# EAGLE design IotaWatt (EAGLE 8.0.0)
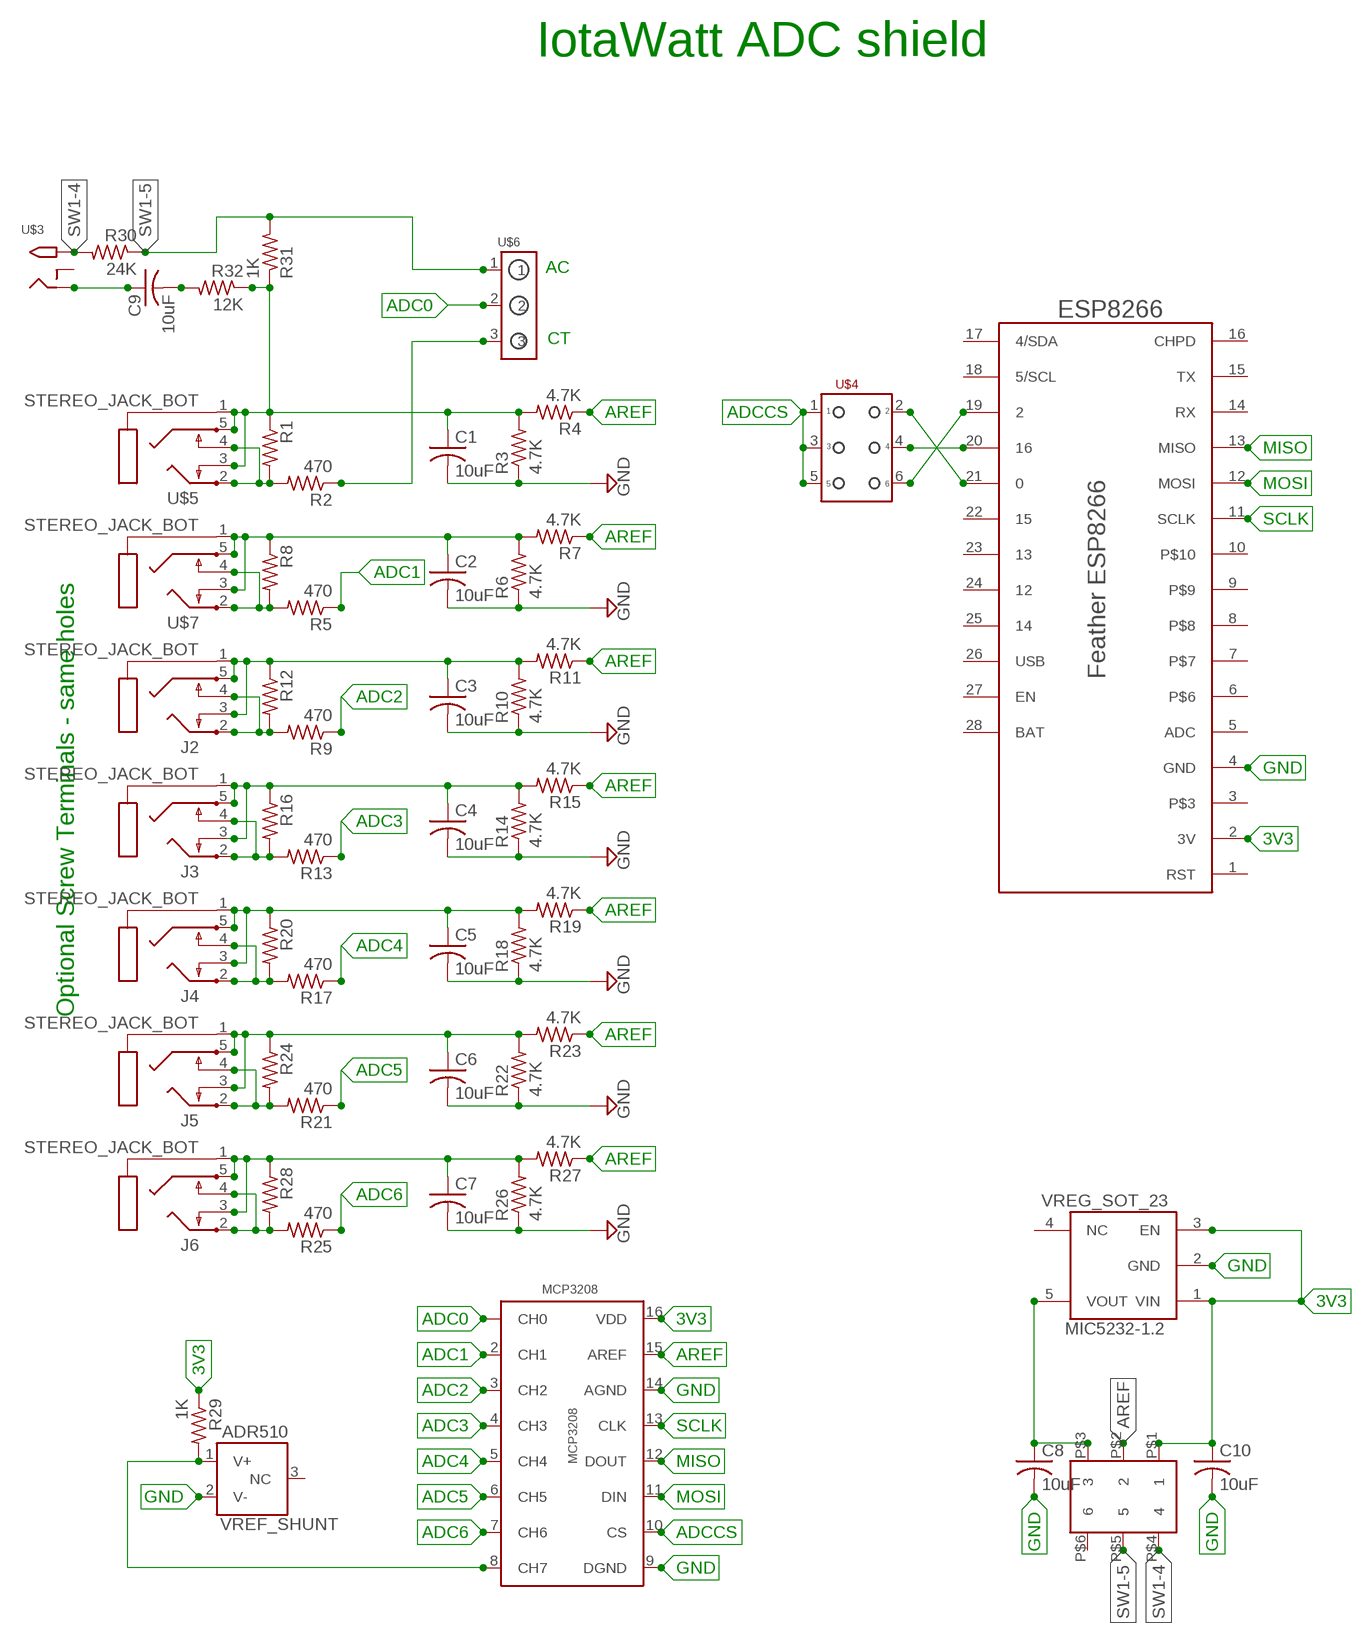
[diagram p0: schematic, sheet 1]

## Parts
ADR510  VREF_SHUNT  [SOT23_3]
C1  10uF  C-USC0805  [C0805]
C2  10uF  C-USC0805  [C0805]
C3  10uF  C-USC0805  [C0805]
C4  10uF  C-USC0805  [C0805]
C5  10uF  C-USC0805  [C0805]
C6  10uF  C-USC0805  [C0805]
C7  10uF  C-USC0805  [C0805]
C8  10uF  C-USC0805  [C0805]
C9  10uF  C-USC0805  [C0805]
C10  10uF  C-USC0805  [C0805]
J2  STEREO_JACK_BOT  [STX3100]
J3  STEREO_JACK_BOT  [STX3100]
J4  STEREO_JACK_BOT  [STX3100]
J5  STEREO_JACK_BOT  [STX3100]
J6  STEREO_JACK_BOT  [STX3100]
MCP3208  MCP3208  [SOIC_16]
MIC5232-1.2  VREG_SOT_23  [SOT23_5]
R1  R-US_FLIPFLOP7  [0805-THM-7]
R2  470  R-US_R0805  [R0805]
R3  4.7K  R-US_R0805  [R0805]
R4  4.7K  R-US_R0805  [R0805]
R5  470  R-US_R0805  [R0805]
R6  4.7K  R-US_R0805  [R0805]
R7  4.7K  R-US_R0805  [R0805]
R8  R-US_FLIPFLOP7  [0805-THM-7]
R9  470  R-US_R0805  [R0805]
R10  4.7K  R-US_R0805  [R0805]
R11  4.7K  R-US_R0805  [R0805]
R12  R-US_FLIPFLOP7  [0805-THM-7]
R13  470  R-US_R0805  [R0805]
R14  4.7K  R-US_R0805  [R0805]
R15  4.7K  R-US_R0805  [R0805]
R16  R-US_FLIPFLOP7  [0805-THM-7]
R17  470  R-US_R0805  [R0805]
R18  4.7K  R-US_R0805  [R0805]
R19  4.7K  R-US_R0805  [R0805]
R20  R-US_FLIPFLOP7  [0805-THM-7]
R21  470  R-US_R0805  [R0805]
R22  4.7K  R-US_R0805  [R0805]
R23  4.7K  R-US_R0805  [R0805]
R24  R-US_FLIPFLOP7  [0805-THM-7]
R25  470  R-US_R0805  [R0805]
R26  4.7K  R-US_R0805  [R0805]
R27  4.7K  R-US_R0805  [R0805]
R28  R-US_FLIPFLOP7  [0805-THM-7]
R29  1K  R-US_R0805  [R0805]
R30  24K  R-US_R0805  [R0805]
R31  1K  R-US_R0805  [R0805]
R32  12K  R-US_R0805  [R0805]
U$1  ESP8266FEATHER  [FEATHERWING]
U$3  2.1MMJACKBOTTHM  [PJ-102A-BOT]
U$4  HEADER_2X3  [HEADER_2X3]
U$5  STEREO_JACK_BOT  [STX3100]
U$6  HEADER_1X3  [HEADER_1X3]
U$7  STEREO_JACK_BOT  [STX3100]
U$8  DPDT_SMT_SW  [JS202011SCQN]

## Nets
3V3: C10.1 MCP3208.16(VDD) MIC5232-1.2.1(VIN) MIC5232-1.2.3(EN) R29.1 U$1.2(3V) U$8.P$1
ADC0: MCP3208.1(CH0) U$6.2
ADC1: MCP3208.2(CH1) R5.1
ADC2: MCP3208.3(CH2) R9.1
ADC3: MCP3208.4(CH3) R13.1
ADC4: MCP3208.5(CH4) R17.1
ADC5: MCP3208.6(CH5) R21.1
ADC6: MCP3208.7(CH6) R25.1
ADC7: ADR510.1(V+) MCP3208.8(CH7) R29.2
ADCCS: MCP3208.10(CS) U$4.1 U$4.3 U$4.5
AREF: MCP3208.15(AREF) R4.1 R7.1 R11.1 R15.1 R19.1 R23.1 R27.1 U$8.P$2
GND: ADR510.2(V-) C1.2 C2.2 C3.2 C4.2 C5.2 C6.2 C7.2 C8.2 C10.2 MCP3208.9(DGND) MCP3208.14(AGND) MIC5232-1.2.2(GND) R3.1 R6.1 R10.1 R14.1 R18.1 R22.1 R26.1 U$1.4(GND)
MISO: MCP3208.12(DOUT) U$1.13(MISO)
MOSI: MCP3208.11(DIN) U$1.12(MOSI)
N$1: R2.1 U$6.3
N$2: C1.1 R1.1 R3.2 R4.2 R31.1 R32.1 U$5.1 U$5.3 U$5.5
N$3: U$1.21 U$4.2
N$4: C2.1 R6.2 R7.2 R8.1 U$7.1 U$7.3 U$7.5
N$5: J2.2 J2.4 R9.2 R12.2
N$6: U$1.19 U$4.6
N$9: U$1.20 U$4.4
N$11: R1.2 R2.2 U$5.2 U$5.4
N$12: C3.1 J2.1 J2.3 J2.5 R10.2 R11.2 R12.1
N$13: C5.1 J4.1 J4.3 J4.5 R18.2 R19.2 R20.1
N$14: J5.2 J5.4 R21.2 R24.2
N$16: C6.1 J5.1 J5.3 J5.5 R22.2 R23.2 R24.1
N$17: C9.2 R32.2
N$18: J6.2 J6.4 R25.2 R28.2
N$19: C7.1 J6.1 J6.3 J6.5 R26.2 R27.2 R28.1
N$20: R5.2 R8.2 U$7.2 U$7.4
N$21: J3.2 J3.4 R13.2 R16.2
N$22: C4.1 J3.1 J3.3 J3.5 R14.2 R15.2 R16.1
N$24: C8.1 MIC5232-1.2.5(VOUT) U$8.P$3
N$26: J4.2 J4.4 R17.2 R20.2
N$27: C9.1 U$3.RING
SCLK: MCP3208.13(CLK) U$1.11(SCLK)
SW1-4: R30.2 U$3.TIP U$8.P$4
SW1-5: R30.1 R31.2 U$6.1 U$8.P$5
Unconnected: ADR510.3(NC) MIC5232-1.2.4(NC) U$1.1(RST) U$1.3 U$1.5(ADC) U$1.6 U$1.7 U$1.8 U$1.9 U$1.10 U$1.14(RX) U$1.15(TX) U$1.16(CHPD) U$1.17(4/SDA) U$1.18(5/SCL) U$1.22 U$1.23 U$1.24 U$1.25 U$1.26(USB) U$1.27(EN) U$1.28(BAT) U$3.RING_SW U$8.P$6

## Notes on the sheet
- IotaWatt ADC shield
- AC
- CT
- Optional Screw Terminals - same holes

## Library data of the parts
ADR510 = IotaWatt_parts:VREF_SHUNT: Voltage Reference Shunt - SOT23-3 (ADR504, etc.)
C1-C10 = adafruit:C-US: CAPACITOR, American symbol
J2-J6 U$5 U$7 = IotaWatt_parts:STEREO_JACK_BOT: Stereo Jack - Bottom Mount
MCP3208 = IotaWatt_parts:MCP3208: MCP3208 12bit SPI ADC
MIC5232-1.2 = IotaWatt_parts:VREG_SOT_23: Generic SOT23-3 Voltage Regulator (MIC5232, etc.)
R1-R32 = adafruit:R-US_: RESISTOR, American symbol
U$1 = IotaWatt_parts:ESP8266FEATHER: Adafruit ESP8266 Feather
U$3 = IotaWatt_parts:2.1MMJACKBOT: Bottom Mount 2.1mm x 5.5mm THM DC jack with internal switch. Digikey part #PJ-102A, 4UCON part #05537 2.1mm x 5.5mm SMT DC jack with internal switch. Digikey part #PJ-002A-SMT, 4UCON part #03267 By microbuilder.eu & adafruit.com
U$4 = IotaWatt_parts:HEADER_2X3: Header 2x3
U$6 = IotaWatt_parts:HEADER_1X3
U$8 = IotaWatt_parts:DPDT_SMT_SW: DPDT smt Switch C&K JS202011SCQN Digikey 401-2002-1-ND

## Board
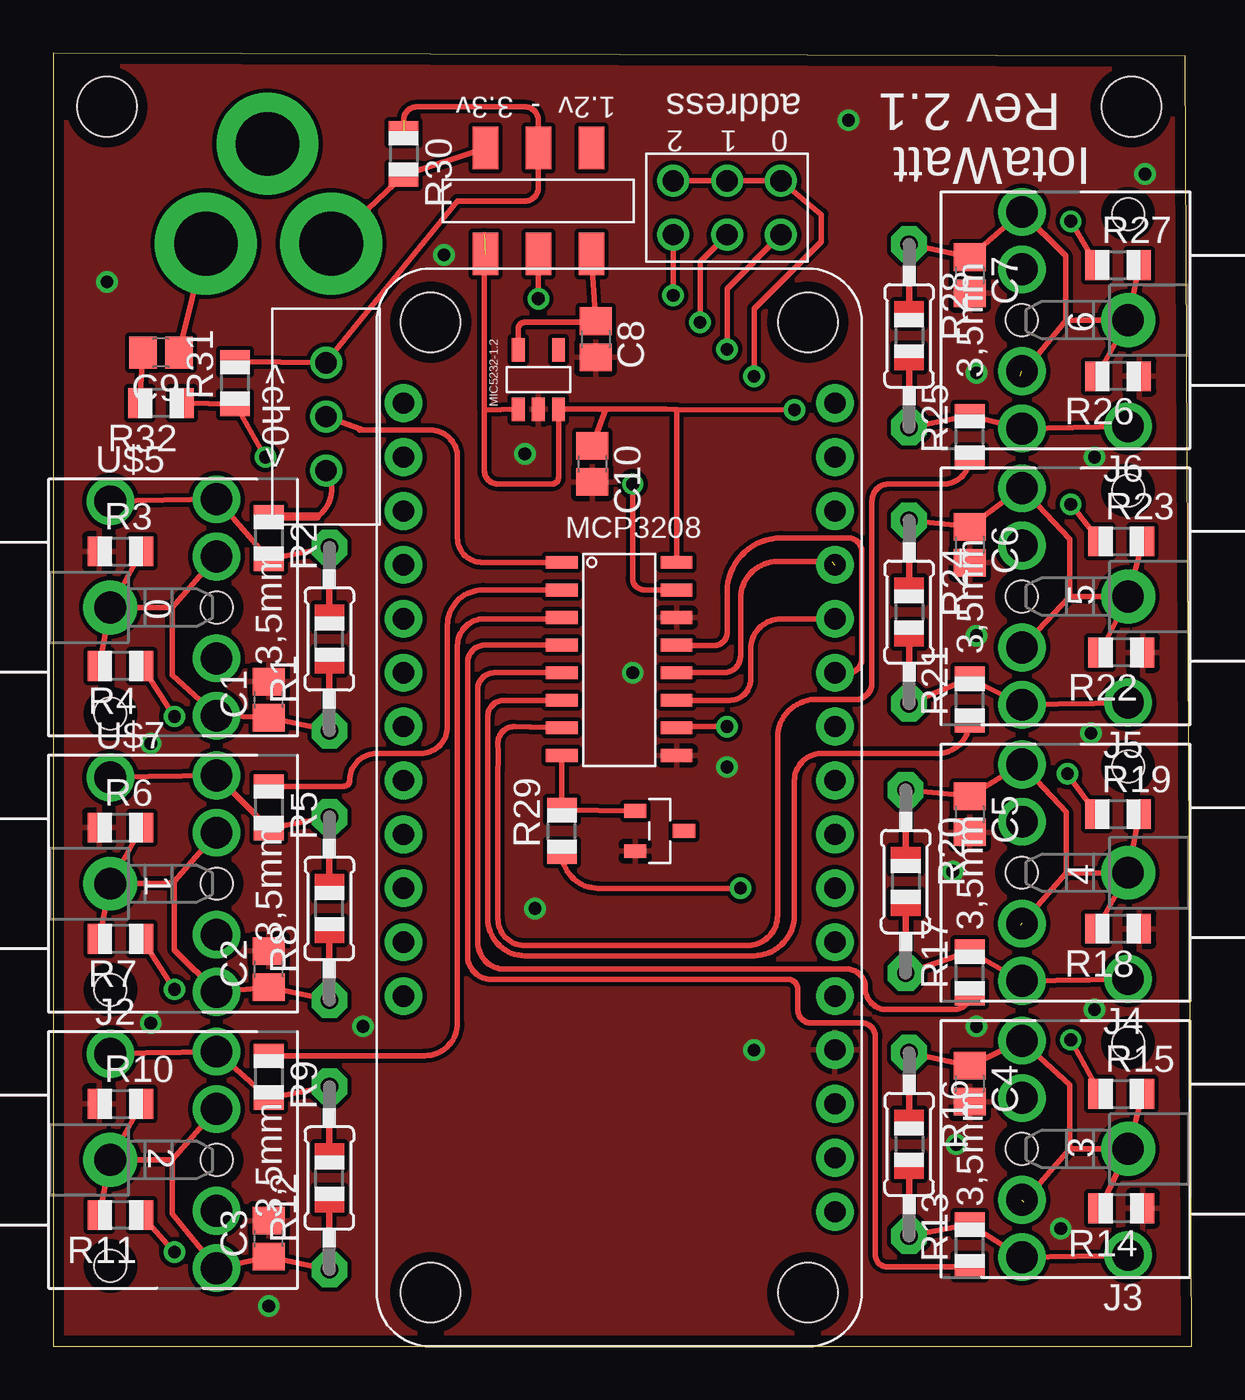
[diagram p1: board, top side]
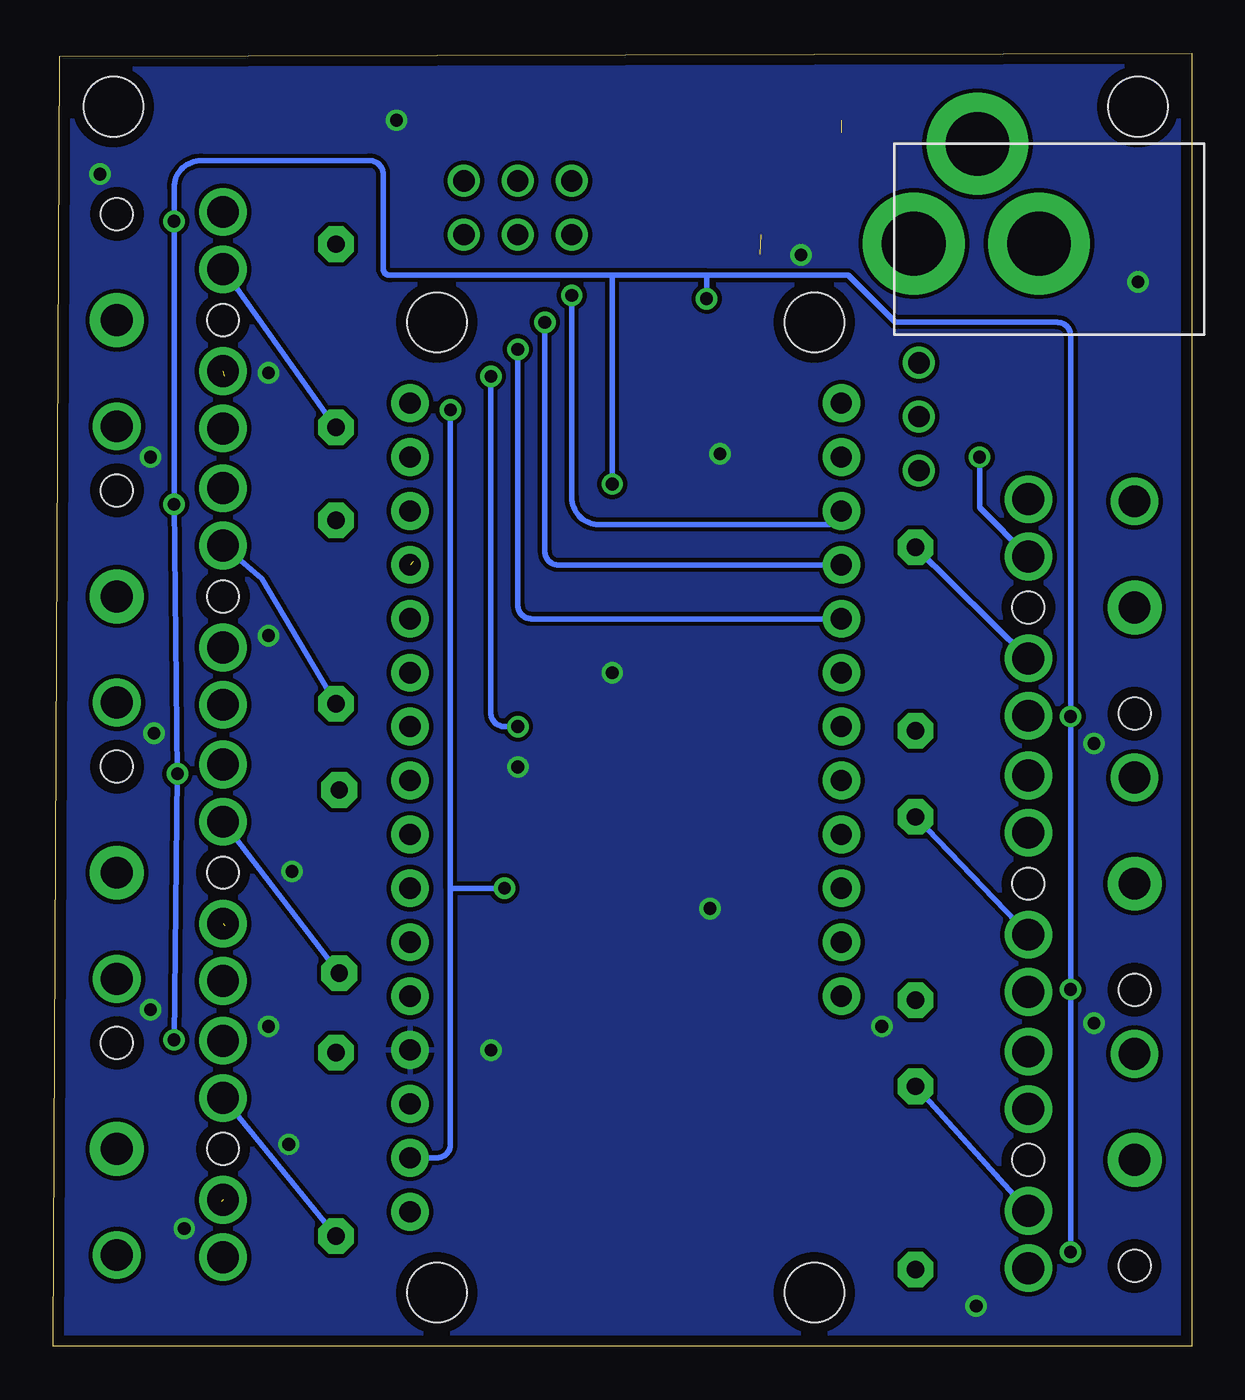
[diagram p2: board, bottom side, seen from below]

Size 53.65 x 60.95 mm. Coordinates in mm from the lower left corner, seen from the top.
Outline: 0,0 53.65,0 53.33,60.79 0,60.95 0,0
Copper layers (1*16): Top 0.035mm / dielectric 1.5mm / Bottom 0.035mm
Design rules "default *": minimum track width 10mil, minimum drill 10mil, track to track 8mil, track to pad 8mil, pad to pad 8mil, via to via 8mil, smd to smd 0mil, copper to edge 20mil, drill to drill 8mil, minimum pad ring 10mil, minimum via ring 8mil, stop-mask expansion 4mil, vias tented up to drill 0mil, thermal gap 10mil
Holes 2.8 mm at 17.78,2.54 35.56,2.54 17.78,48.26 35.56,48.26 2.54,58.42 50.8,58.42

### Footprints (pad centres in the part's own frame; a part is rotated, then mirrored left to right if it is on the bottom)
SOT23_3 = smd 1.05 x 0.65: 1 -1.15,0.95; 2 -1.15,-0.95; 3 1.15,0
C0805 = smd 1.3 x 1.5: 1 -0.85,0; 2 0.85,0
STX3100 = drill 1.5 pad 2.54: 1 2.7,-0.1 | drill 1.5: 2 7.7,5; 3 7.7,2.3; 4 7.7,-2.5; 5 7.7,-5.2; P$1 2.7,4.9 | hole 1.5: 2.7,-5.1; 7.7,-0.1
SOIC_16 = smd 1.5 x 0.6: 1 -2.7,5.2; 2 -2.7,3.9; 3 -2.7,2.6; 4 -2.7,1.3; 5 -2.7,0; 6 -2.7,-1.3; 7 -2.7,-2.6; 8 -2.7,-3.9; 9 2.7,-3.9; 10 2.7,-2.6; 11 2.7,-1.3; 12 2.7,0; 13 2.7,1.3; 14 2.7,2.6; 15 2.7,3.9; 16 2.7,5.2
SOT23_5 = smd 1.1 x 0.6: 1 -1.4,0.95; 2 -1.4,0; 3 -1.4,-0.95; 4 1.4,-0.95; 5 1.4,0.95
0805-THM-7 = drill 0.813 pad 1.676 octagon: 1 -4.318,0; 2 4.318,0
R0805 = smd 1.1 x 1.4: 1 -1,0; 2 1,0
FEATHERWING = drill 1 pad 1.778: 1 6.35,1.27; 2 8.89,1.27; 3 11.43,1.27; 4 13.97,1.27; 5 16.51,1.27; 6 19.05,1.27; 7 21.59,1.27; 8 24.13,1.27; 9 26.67,1.27; 10 29.21,1.27; 11 31.75,1.27; 12 34.29,1.27; 13 36.83,1.27; 14 39.37,1.27; 15 41.91,1.27; 16 44.45,1.27; 17 44.45,21.59; 18 41.91,21.59; 19 39.37,21.59; 20 36.83,21.59; 21 34.29,21.59; 22 31.75,21.59; 23 29.21,21.59; 24 26.67,21.59; 25 24.13,21.59; 26 21.59,21.59; 27 19.05,21.59; 28 16.51,21.59
PJ-102A-BOT = drill 3 pad 4.8: RING -0.1,-3.39; RING_SW 4.6,-6.29; TIP -0.1,-9.29
HEADER_2X3 = drill 1: 1 -1.27,2.54; 2 1.27,2.54; 3 -1.27,0; 4 1.27,0; 5 -1.27,-2.54; 6 1.27,-2.54
HEADER_1X3 = drill 1: 1 0,2.54; 2 0,0; 3 0,-2.54
JS202011SCQN = smd 2 x 1.2: P$1 -2.5,2.5; P$2 -2.5,0; P$3 -2.5,-2.5; P$4 2.5,2.5; P$5 2.5,0; P$6 2.5,-2.5

### Placement (x,y rotation side)
ADR510  28.57,24.29 0 top
C1  10.16,30.48 90 top
C2  10.16,17.78 90 top
C3  10.16,5.08 90 top
C4  43.18,12.38 270 top
C5  43.18,25.08 270 top
C6  43.18,37.78 270 top
C7  43.18,50.48 270 top
C8  25.56,47.47 270 top
C9  5.08,46.83 180 top
C10  25.4,41.59 270 top
J2  0,8.89 0 top
J3  53.34,9.21 180 top
J4  53.34,22.23 180 top
J5  53.34,35.24 180 top
J6  53.34,48.26 180 top
MCP3208  26.67,31.75 0 top
MIC5232-1.2  22.86,45.56 90 top
R1  13.02,33.34 90 top
R2  10.16,38.1 270 top
R3  3.17,37.47 0 top
R4  3.17,32.07 180 top
R5  10.16,25.4 270 top
R6  3.17,24.45 0 top
R7  3.17,19.21 180 top
R8  13.02,20.64 90 top
R9  10.16,12.7 270 top
R10  3.17,11.43 0 top
R11  3.17,6.19 180 top
R12  13.02,7.94 90 top
R13  43.18,4.76 90 top
R14  50.32,6.51 180 top
R15  50.32,11.91 0 top
R16  40.32,9.53 270 top
R17  43.18,17.62 90 top
R18  50.16,19.68 180 top
R19  50.16,25.08 0 top
R20  40.16,21.91 270 top
R21  43.18,30.48 90 top
R22  50.32,32.7 180 top
R23  50.32,37.94 0 top
R24  40.32,34.61 270 top
R25  43.18,42.86 90 top
R26  50.16,45.72 180 top
R27  50.16,50.96 0 top
R28  40.32,47.62 270 top
R29  23.97,24.29 90 top
R30  16.51,56.2 270 top
R31  8.57,45.4 90 top
R32  5.08,44.45 180 top
U$1  38.1,0 90 top
U$3  3.81,52.07 90 top
U$4  31.75,53.66 270 top
U$5  0,34.92 0 top
U$6  12.86,43.81 0 top
U$7  0,21.91 0 top
U$8  22.86,53.98 90 top

### Tracks (layer width: path | path; a pad name or v marks a point on that pad's centre or on a via)
3V3  (via drill 0.6)  (1 unrouted)
  Top 0.254: R29.1 arc90 25.67,21.59 v32.38,21.59 | 20.32,44.13 20.32,52.39 | 20.32,44.13 20.32,41.27 arc90 20.95,40.64 23.5,40.64 arc90 23.81,40.95 MIC5232-1.2.3 26.04,44.16 | MIC5232-1.2.1 20.32,44.13 | 26.04,44.16 28.86,44.16 29.37,44.16 | 29.21,37.11 arc90 MCP3208.16 | 26.04,44.16 C10.1 | 29.37,44.16 v34.92,44.13 | MCP3208.16 | MCP3208.16 29.37,44.16
  Bottom 0.254: U$1.2 35.56,8.89 arc-90 34.92,9.53 34.92,21.59 | 34.92,21.59 v34.92,44.13 | v32.38,21.59 34.92,21.59
ADC0
  Top 0.254: 14.45,43.18 14.61,43.18 | 14.61,43.18 17.78,43.18 arc-90 19.05,41.91 19.05,38.1 arc90 20.2,36.95 MCP3208.1 | 14.61,43.18 U$6.2
ADC1
  Top 0.254: R5.1 13.7,26.4 arc90 13.97,26.67 arc-90 15.24,27.94 17.3,27.94 arc90 18.57,29.21 18.57,33.97 arc-90 20.25,35.65 MCP3208.2
ADC2
  Top 0.254: R9.1 17.51,13.7 arc90 19.05,15.24 19.05,33.02 arc-90 20.32,34.29 23.91,34.29 arc90 MCP3208.3
ADC3
  Top 0.254: 43.13,3.33 arc-90 R13.1 39.26,3.76 arc-90 38.73,4.29 38.73,14.61 arc90 38.1,15.24 35.72,15.24 arc-90 35.08,15.88 35.08,16.83 arc90 34.61,17.3 20.64,17.3 arc-90 19.53,18.41 19.53,32.23 arc-90 20.35,33.05 MCP3208.4
ADC4
  Top 0.254: MCP3208.5 20.8,31.75 arc90 20,30.96 20,19.05 arc90 21.27,17.78 37.31,17.78 arc-90 38.26,16.99 38.26,16.83 arc90 39.37,15.88 42.43,15.88 arc90 R17.1
ADC5
  Top 0.254: R21.1 arc-90 41.64,27.94 36.2,27.94 arc90 34.92,26.67 34.92,20.32 arc-90 33.02,18.41 22.23,18.41 arc-90 20.48,20.16 20.48,29.69 arc-90 21.24,30.45 MCP3208.6
ADC6
  Top 0.254: R25.1 arc-90 41.96,40.64 39.37,40.64 arc90 38.58,39.85 38.58,31.27 arc-90 37.78,30.48 36.2,30.48 arc90 34.13,28.89 34.13,20.32 arc-90 32.7,18.89 22.23,18.89 arc-90 20.95,20.16 20.95,27.15 arc3 20.95,28.42 arc-93 21.75,29.21 arc0 MCP3208.7
ADC7
  Top 0.254: MCP3208.8 R29.2 ADR510.1
ADCCS  (via drill 0.6)
  Top 0.254: U$4.5 U$4.3 U$4.1 36.2,53.34 36.2,52.07 33.02,48.9 v33.02,45.72 | 29.84,29.21 v31.75,29.21 | 29.84,29.21 29.21,29.21 | MCP3208.10 29.84,29.21
  Bottom 0.254: v31.75,29.21 32.38,29.21 arc90 33.02,29.84 v33.02,45.72
AREF  (via drill 0.6)
  Top 0.254: R11.1 v5.71,4.45 | R7.1 v5.71,16.83 | R4.1 v5.71,29.69 | R23.1 v47.94,39.69 | R19.1 v47.78,26.99 | R15.1 v47.94,14.45 | R27.1 v47.94,53.02 | MCP3208.15 27.85,35.65 arc-90 27.3,36.2 v27.3,40.64 | v22.86,49.37 U$8.P$2
  Bottom 0.254: v47.94,14.45 v47.78,26.99 v47.94,39.69 v47.94,53.02 47.94,54.61 arc90 46.67,55.88 38.73,55.88 arc90 38.1,55.24 38.1,50.8 arc-90 37.78,50.48 27.3,50.48 | v5.71,4.45 v5.71,16.83 v5.71,29.69 5.71,47.62 arc-90 6.35,48.26 13.97,48.26 16.19,50.48 22.86,50.48 | 22.86,50.48 27.3,50.48 | v27.3,40.64 27.3,50.48 | v22.86,49.37 22.86,50.48
GND  (via drill 0.6)
  other vias: 51.44,55.24 2.54,50.16 10.16,1.91 22.23,42.07 4.6,28.42 14.61,15.08 42.55,9.53 42.39,22.38 43.5,45.88 4.6,15.24 47.47,5.56 22.7,20.64 31.75,27.3 27.3,31.75 18.41,51.44 37.47,57.78 33.02,13.97 49.05,15.88 48.9,28.89 49.05,41.91 43.5,33.5 43.5,15.08
  pour Top: 0,60.96 0,0 53.34,0 53.34,60.96
  pour Bottom: 0,0 0,60.96 53.34,61.59 53.34,0.64
MISO  (1 unrouted)
  Top 0.254: 36.67,36.99 34.13,36.99 arc90 32.38,35.24 32.38,32.54 arc-90 31.59,31.75 MCP3208.12
MOSI
  Top 0.254: MCP3208.11 31.88,30.45 arc90 32.86,31.43 32.86,32.86 arc-90 34.29,34.29 U$1.12
N$1
  Top 0.254: U$6.3 arc-90 12.43,39.1
  Top 0.406: 12.43,39.1 R2.1
N$2  (via drill 0.6)
  Top 0.254: U$5.1 R4.2 | R3.2 U$5.1 | 5.62,34.83 U$5.3 | 5.62,34.83 U$5.1 | 5.62,34.83 5.62,31.65 U$5.5 C1.1 R1.1 | v10,41.91 R31.1 R32.1
  Bottom 0.254: U$5.3 10,39.53 v10,41.91
N$3  (via drill 0.6)
  Top 0.254: v31.75,46.99 31.75,49.85 U$4.2
  Bottom 0.254: U$1.21 31.11,34.29 arc90 31.75,34.92 v31.75,46.99
N$4
  Top 0.254: 5.72,21.91 U$7.3 | 5.72,21.91 5.3,21.81 U$7.1 | 5.72,21.91 5.72,18.69 U$7.5 C2.1 R8.1 | U$7.1 R6.2 | U$7.1 R7.2
N$5
  Top 0.254: 2.7,13.81 J2.2 R9.2 R12.2
  Bottom 0.254: J2.4 R12.2
N$6  (via drill 0.6)
  Top 0.254: v29.21,49.53 U$4.6
  Bottom 0.254: U$1.19 arc90 17.14,38.73 27.94,38.73 arc90 29.21,40.01 v29.21,49.53
N$9  (via drill 0.6)
  Top 0.254: v30.48,48.26 30.48,51.12 U$4.4
  Bottom 0.254: U$1.20 29.84,36.83 arc90 30.48,37.47 v30.48,48.26
N$11
  Top 0.254: 2.7,39.85 U$5.2 R2.2 R1.2
  Bottom 0.254: R1.2 U$5.4
N$12
  Top 0.254: R10.2 J2.1 | J2.1 R11.2 | 5.62,8.79 J2.1 | 5.62,8.79 J2.3 | 5.62,8.79 5.62,6.25 J2.5 C3.1 R12.1
N$13  (1 unrouted)
  Top 0.254: R19.2 J4.1 | R18.2 J4.1 | 47.73,22.32 J4.1 | 47.73,22.32 45.56,19.84 | 47.73,22.32 47.73,25.18 J4.5 C5.1 R20.1
N$14
  Top 0.254: 50.8,30.32 J5.2 R21.2 R24.2
  Bottom 0.254: J5.4 43.81,36.2 R24.2
N$16
  Top 0.254: R23.2 J5.1 | R22.2 J5.1 | 47.88,35.34 J5.1 | 47.88,35.34 J5.3 | 47.88,35.34 47.88,38.04 J5.5 C6.1 R24.1
N$17
  Top 0.254: C9.2 R32.2
N$18
  Top 0.254: 50.48,43.34 J6.2 R25.2 R28.2
  Bottom 0.254: R28.2 J6.4
N$19  (1 unrouted)
  Top 0.254: R27.2 J6.1 | R26.2 J6.1 | J6.1 48.2,48.36 47.7,48.34 | 47.7,48.34 45.56,45.72 | 47.7,48.34 47.7,51.4 J6.5 C7.1 R28.1
N$20
  Top 0.254: 7.78,26.83 U$7.2 | U$7.2 2.86,26.83 | R8.2 R5.2 U$7.2
  Bottom 0.254: U$7.4 R8.2
N$21
  Top 0.254: R16.2 R13.2 J3.2 50.8,4.29
  Bottom 0.254: J3.4 R16.2
N$22  (1 unrouted)
  Top 0.254: R15.2 J3.1 | R14.2 J3.1 | 47.88,9.31 J3.1 | 47.88,9.31 45.72,6.83 | 47.88,9.31 47.88,12.32 J3.5 C4.1 R16.1
N$24
  Top 0.254: MIC5232-1.2.5 21.91,47.95 arc-90 22.23,48.26 25.5,48.26 arc90 C8.1 U$8.P$3
N$26
  Top 0.254: 50.48,17.3 J4.2 R17.2 R20.2
  Bottom 0.254: J4.4 R20.2
N$27
  Top 0.254: C9.1 U$3.RING
SCLK
  Top 0.254: 29.4,33.02 arc-90 MCP3208.13 30.48,33.02 | 30.48,33.02 31.11,33.02 arc90 31.75,33.66 31.75,35.56 arc-90 34.29,38.1 37.47,38.1 arc-90 38.1,37.47 38.1,32.38 arc-90 37.47,31.75 U$1.11 | 30.48,33.02 30,33.02
SW1-4
  Top 0.254: U$3.TIP R30.2 U$8.P$4
SW1-5  (1 unrouted)
  Top 0.254: 16.51,57.78 arc-90 17.14,58.42 22.23,58.42 arc-90 22.86,57.78 U$8.P$5 22.86,54.61 arc-90 22.23,53.98 19.05,53.98 13.43,47.1 U$6.1 R31.2

### Text on the board
tPlace: 1.2v - 3.3v | address | Rev 2.1 | 2 | 1 | 0 | IotaWatt | 6 | <ch0> | 0 | 5 | 1 | 4 | 2 | 3